# Altium schematic sheet Hardware Tutorial - Controller Board Interface.SchDoc: Hardware Tutorial - Controller Board interface
size B; Organization: Midnight Sun Solar Rayce Car Team; Address1: University of Waterloo; Address2: 200 University Ave W; Address3: Waterloo, ON, Canada; Address4: N2L 3E9; Website: www.uwmidsun.com; ProjectName: ProjectName
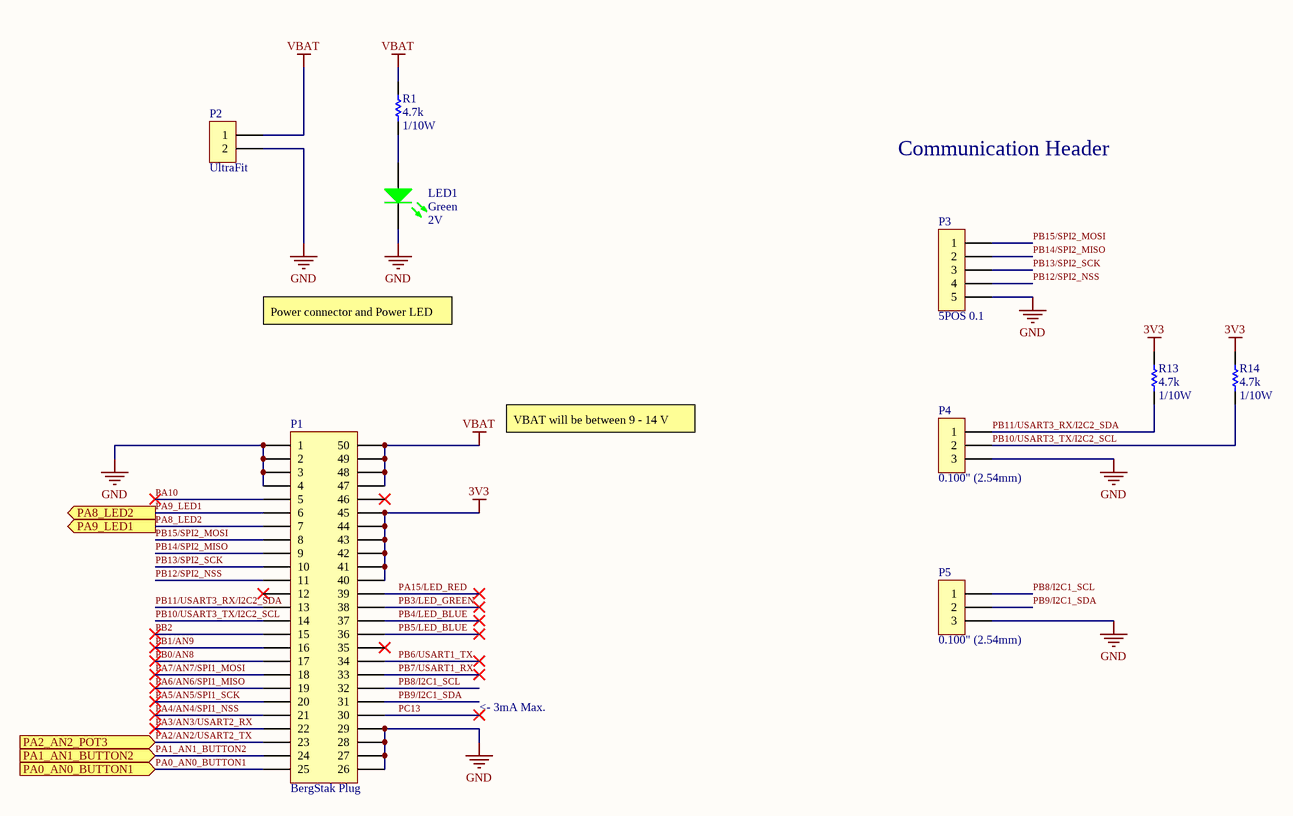
[diagram p0: Hardware Tutorial - Controller Board Interface.SchDoc]

## Parts
LED1  Color: Green  Voltage - Forward (Vf) (Typ): 2V  [LED_0603]  (hidden comment: LED GREEN CLEAR 2V 0603)
P1  Series: BergStak Plug  [CONN, Bergstak 50 Pos Plug]  (hidden comment: CONN 50POS Bergstak Plug 0.02")
P2  Series: UltraFit  [CONN, 2POS ULTRA-FIT]  (hidden comment: CONN 2POS ULTRA-FIT 0.138")
P3  5POS 0.1  [CONN, 5POS HEADR 0.1"]
P4  Pitch - Mating: 0.100" (2.54mm)  [CONN, 3POS 0.100" Header, 1 ROW]  (hidden comment: CONN 3POS HEADR MALE 0.1")
P5  Pitch - Mating: 0.100" (2.54mm)  [CONN, 3POS 0.100" Header, 1 ROW]  (hidden comment: CONN 3POS HEADR MALE 0.1")
R1  Resistance (Ohms): 4.7k  Power (Watts): 1/10W  [RES, 0603]  (hidden comment: RES 4.7K OHM 1% 1/10W 0603)
R13  Resistance (Ohms): 4.7k  Power (Watts): 1/10W  [RES, 0603]  (hidden comment: RES 4.7K OHM 1% 1/10W 0603)
R14  Resistance (Ohms): 4.7k  Power (Watts): 1/10W  [RES, 0603]  (hidden comment: RES 4.7K OHM 1% 1/10W 0603)

## Ports
PA0_AN0_BUTTON1 (in), PA1_AN1_BUTTON2 (in), PA2_AN2_POT3 (in), PA8_LED2 (out), PA9_LED1 (out)

## Nets
3V3: P1.40 P1.41 P1.42 P1.43 P1.44 P1.45 R13.1 R14.1
GND: LED1.2(K) P1.1 P1.2 P1.3 P1.4 P1.26 P1.27 P1.28 P1.29 P2.2 P3.5 P4.3 P5.3
VBAT: P1.47 P1.48 P1.49 P1.50 P2.1 R1.1
PA0_AN0_BUTTON1: P1.25 ; port PA0_AN0_BUTTON1
PA1_AN1_BUTTON2: P1.24 ; port PA1_AN1_BUTTON2
PA2/AN2/USART2_TX: P1.23 ; port PA2_AN2_POT3
PA3/AN3/USART2_RX: P1.22
PA4/AN4/SPI1_NSS: P1.21
PA5/AN5/SPI1_SCK: P1.20
PA6/AN6/SPI1_MISO: P1.19
PA7/AN7/SPI1_MOSI: P1.18
PA8_LED2: P1.7 ; port PA9_LED1
PA9_LED1: P1.6 ; port PA8_LED2
PA10: P1.5
PA15/LED_RED: P1.39
PB0/AN8: P1.17
PB1/AN9: P1.16
PB2: P1.15
PB3/LED_GREEN: P1.38
PB4/LED_BLUE: P1.37
PB5/LED_BLUE: P1.36
PB6/USART1_TX: P1.34
PB7/USART1_RX: P1.33
PB8/I2C1_SCL: P1.32 P5.1
PB9/I2C1_SDA: P1.31 P5.2
PB10/USART3_TX/I2C2_SCL: P1.14 P4.2 R14.2
PB11/USART3_RX/I2C2_SDA: P1.13 P4.1 R13.2
PB12/SPI2_NSS: P1.11 P3.4
PB13/SPI2_SCK: P1.10 P3.3
PB14/SPI2_MISO: P1.9 P3.2
PB15/SPI2_MOSI: P1.8 P3.1
PC13: P1.30
NetLED1_1: LED1.1(A) R1.2

Not connected (* = marked no-connect by the designer): P1 12* 35* 46*

## Notes on the sheet
- Communication Header
- Power connector and Power LED
- VBAT will be between 9 - 14 V
- <- 3mA Max.
- PROJECT
- DOCUMENT
- DRAWN BY
- LAST MODIFIED
- PART NUMBER
- REVISION
- SHEET
- VARIANT
- OF
- Engineering 5 - 1002
  University of Waterloo
  (519) 888-4567 x32978
  hardware@uwmidsun.com

## Library data of the parts
LED1 = LED GREEN CLEAR 2V 0603: Green 572nm LED Indication - Discrete 2V 0603 (1608 Metric); Manufacturer: Wurth Electronics Inc.; Manufacturer Part Number: 150060VS75000; Lens Color: Colorless; Millicandela Rating: 40mcd; Lens Style/Size: Rectangle with Flat Top, 1.10mm x 0.70mm; Current - Test: 20mA; Viewing Angle: 140°; Wavelength - Dominant: 570nm; Supplier 1: Digi-Key; RoHS: RoHS Compliant; Category: Optoelectronics; Stock 1: 9408; Pricing 1: 1=0.21, 100=0.1617, 500=0.13964 (CAD); Packaging: Cut Tape (CT); Part Status: Active; Lens Transparency: Clear; Mounting Type: Surface Mount; Wavelength - Peak: 572nm; Features: -; Package / Case: 0603 (1608 Metric); Supplier Device Package: 0603; Size / Dimension: 1.60mm L x 0.80mm W; Height (Max): 0.80mm; ComponentLink1URL: http://katalog.we-online.de/led/datasheet/150060VS75000.pdf; ComponentLink1Description: http://katalog.we-online.de/led/datasheet/150060VS75000.pdf; Supplier Part Number 1: 732-4980-1-ND
P1 = CONN 50POS Bergstak Plug 0.02": 50 Position Connector Plug, Outer Shroud Contacts Surface Mount Gold; Manufacturer 1: Amphenol FCI; Manufacturer Part Number 1: 10132797-055100LF; Number of Positions: 50; Mated Stacking Heights: 5mm; Pitch: 0.020" (0.50mm); Supplier 1: Digi-Key; Supplier Part Number 1: 609-5226-1-ND; Packaging: Cut Tape (CT); Part Status: Active; Connector Type: Plug, Outer Shroud Contacts; Number of Rows: 2; Mounting Type: Surface Mount; Contact Finish: Gold; Contact Finish Thickness: 1µin (0.025µm); Height Above Board: 0.169" (4.30mm); ComponentLink1URL: http://portal.fciconnect.com/Comergent//fci/drawing/10132797.pdf; ComponentLink1Description: http://portal.fciconnect.com/Comergent//fci/drawing/10132797.pdf
P2 = CONN 2POS ULTRA-FIT 0.138": Connector Header Through Hole 2 position 0.138" (3.50mm); Manufacturer: Molex; Manufacturer Part Number: 1722871102; Number of Positions: 2; Connector Type: Male Pin; Pitch: 0.138inch; ComponentLink1URL: http://www.molex.com/pdm_docs/sd/1722861302_sd.pdf; ComponentLink1Description: http://www.molex.com/pdm_docs/sd/1722861302_sd.pdf; Supplier 1: Digi-Key; RoHS: Yes; Stock 1: 2743; Pricing 1: 1 = 0.78000, 10 = 0.68800, 100 = 0.59380, 500 = 0.48582, 1000 = 0.43184, 5000 = 0.37786, 10000 = 0.35897 (USD); Mount: Through Hole; Color: Black; Contact Plating: Tin; Packaging: Tray; Number of Rows: 1; Termination: Solder; Fastening Type: Latch; Supplier Part Number 1: WM11701-ND
P3 = CONN 5POS HEADR MALE 0.1in: 5 Positions Header, Breakaway Connector 0.100" (2.54mm) Through Hole Tin; Manufacturer 1: Molex; Manufacturer Part Number 1: 0022284050; Description 1: Conn Unshrouded Header HDR 5 POS 2.54mm Solder ST Thru-Hole KK® Bag; Contact Resistance: 20mR; Number of Positions: 5; Gender: Male; Connector Type: Male Pin; Max Voltage Rating (AC): 250V; Supplier 1: Digi-Key; Supplier Part Number 1: WM50014-05-ND; Stock 1: 3161; Pricing 1: 1=0.22, 10=0.21, 25=0.1796, 50=0.157, 100=0.1459, 250=0.129, 500=0.1234 (USD); Mount: Through Hole; Colour: Black; Contact Plating: Nickel,Tin; Contact Material: Bronze,Brass; Housing Colour: Black; Housing Material: Nylon; Min Operating Temperature: 0°C; Max Operating Temperature: 75°C; Packaging: Bulk; Number of Rows: 1; Termination: Solder; Number of Contacts: 5; Orientation: Straight; Max Voltage Rating (DC): 250V; Length: 12.7mm; Pitch: 2.54mm; Depth: 2.49mm; Contact Mating Length: 0.24inch; ComponentLink1URL: https://datasheet.ciiva.com/6814/022284363-sd-6814049.pdf; ComponentLink1Description: https://datasheet.ciiva.com/6814/022284363-sd-6814049.pdf; ComponentLink2URL: https://datasheet.ciiva.com/14804/179390022284050-pcb-headers-14804361.pdf; ComponentLink2Description: https://datasheet.ciiva.com/14804/179390022284050-pcb-headers-14804361.pdf; ComponentLink3URL: https://datasheet.ciiva.com/15217/getdatasheetpartid-256138-15217709.pdf; ComponentLink3Description: https://datasheet.ciiva.com/15217/getdatasheetpartid-256138-15217709.pdf
P4 P5 = CONN 3POS HEADR MALE 0.1": 3 Positions Header Connector 0.100" (2.54mm) Through Hole Gold; Manufacturer 1: Wurth Electronics Inc.; Manufacturer Part Number 1: 61300311121; Style: Board to Board or Cable; Shrouding: Unshrouded; Number of Positions: 3; Number of Positions Loaded: All; Contact Length - Mating: 0.236" (6.00mm); Contact Length - Post: 0.118" (3.00mm); Overall Contact Length: 0.454" (11.54mm); Material Flammability Rating: UL94 V-0; Current Rating: 3A; Voltage: 250V; Supplier 1: Digi-Key; Supplier Part Number 1: 732-5316-ND; Packaging: Bulk; Part Status: Active; Connector Type: Header; Contact Type: Male Pin; Number of Rows: 1; Row Spacing - Mating: -; Mounting Type: Through Hole; Termination: Solder; Fastening Type: -; Insulation Height: 0.100" (2.54mm); Contact Shape: Square; Contact Finish - Mating: Gold; Contact Finish Thickness - Mating: -; Contact Finish - Post: -; Contact Material: Copper Alloy; Insulation Material: Polybutylene Terephthalate (PBT); Operating Temperature: -40°C ~ 125°C; Ingress Protection: -; Insulation Color: Black; Mated Stacking Heights: -; Contact Finish Thickness - Post: -; ComponentLink1URL: http://katalog.we-online.de/em/datasheet/6130xx11121.pdf; ComponentLink1Description: http://katalog.we-online.de/em/datasheet/6130xx11121.pdf
R1 R13 R14 = RES 4.7K OHM 1% 1/10W 0603: 4.7k Ohm ±1% 0.1W, 1/10W Chip Resistor 0603 (1608 Metric) Moisture Resistant Thick Film; Manufacturer 1: Yageo; Manufacturer Part Number 1: RC0603FR-074K7L; Description 1: RES SMD 4.7K OHM 1% 1/10W 0603; Temperature Coefficient: ±100ppm/°C; Supplier 1: Digi-Key; Supplier Part Number 1: 311-4.70KHRCT-ND; RoHS: RoHS Compliant; Category: Resistors; Stock 1: 3487566; Pricing 1: 1=0.16, 10=0.022, 100=0.0089, 1000=0.00402, 2500=0.00349 (CAD); Packaging: Cut Tape (CT); Part Status: Active; Composition: Thick Film; Features: Moisture Resistant; Operating Temperature: -55°C ~ 155°C; Package / Case: 0603 (1608 Metric); Supplier Device Package: 0603; Size / Dimension: 0.063" L x 0.031" W (1.60mm x 0.80mm); Height - Seated (Max): 0.022" (0.55mm); Failure Rate: -; ComponentLink1URL: http://www.yageo.com/documents/recent/PYu-RC_Group_51_RoHS_L_7.pdf; ComponentLink1Description: http://www.yageo.com/documents/recent/PYu-RC_Group_51_RoHS_L_7.pdf; Tolerance: ±1%